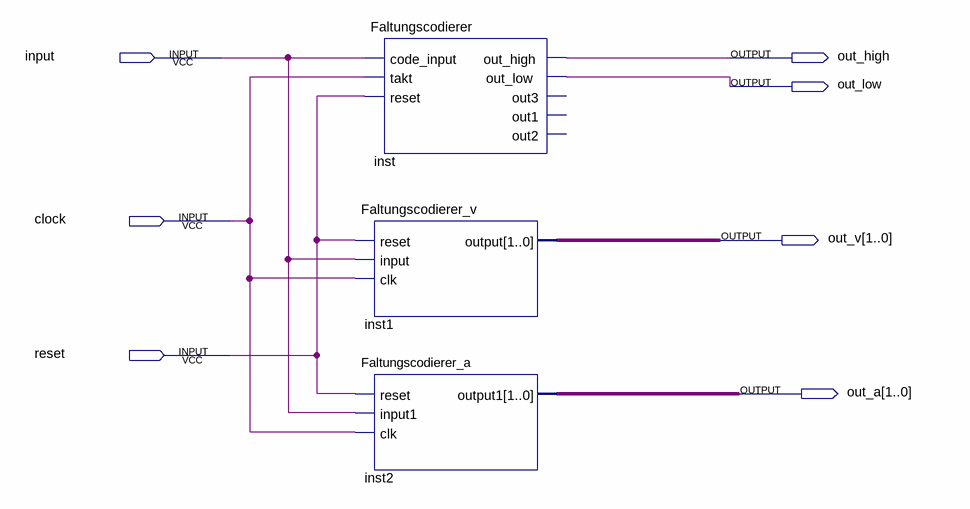
[diagram p0: schematic sheet]
// Quartus schematic Faltungscodierer_gesamt.bdf as structural Verilog: 3 symbols, 7 pins
module Faltungscodierer_gesamt (
  input  \input ,
  input  clock,
  input  reset,
  output out_high,
  output out_low,
  output [1:0] out_v,
  output [1:0] out_a
);

  Faltungscodierer inst (
    .code_input(\input ), .takt(clock), .reset(reset), .out_high(out_high), .out_low(out_low));  // open: out3, out1, out2
  Faltungscodierer_v inst1 (.reset(reset), .\input (\input ), .clk(clock), .\output (out_v));
  Faltungscodierer_a inst2 (.reset(reset), .input1(\input ), .clk(clock), .output1(out_a));
endmodule
